# Altium schematic sheet mechanical.SchDoc: CS - Mechanical
size Letter; CheckedBy: J. Brinton; CompanyName: Signal Laboratories, Inc.; DrawnBy: J. Brinton; Engineer: J. Brinton; Address1: 3479 Edison Way; Address2: Menlo Park CA 94025; Address3: +1 (877) 778-8435; Address4: siglabs.com; Revision: 3; SheetNumber: 47; SheetTotal: 47
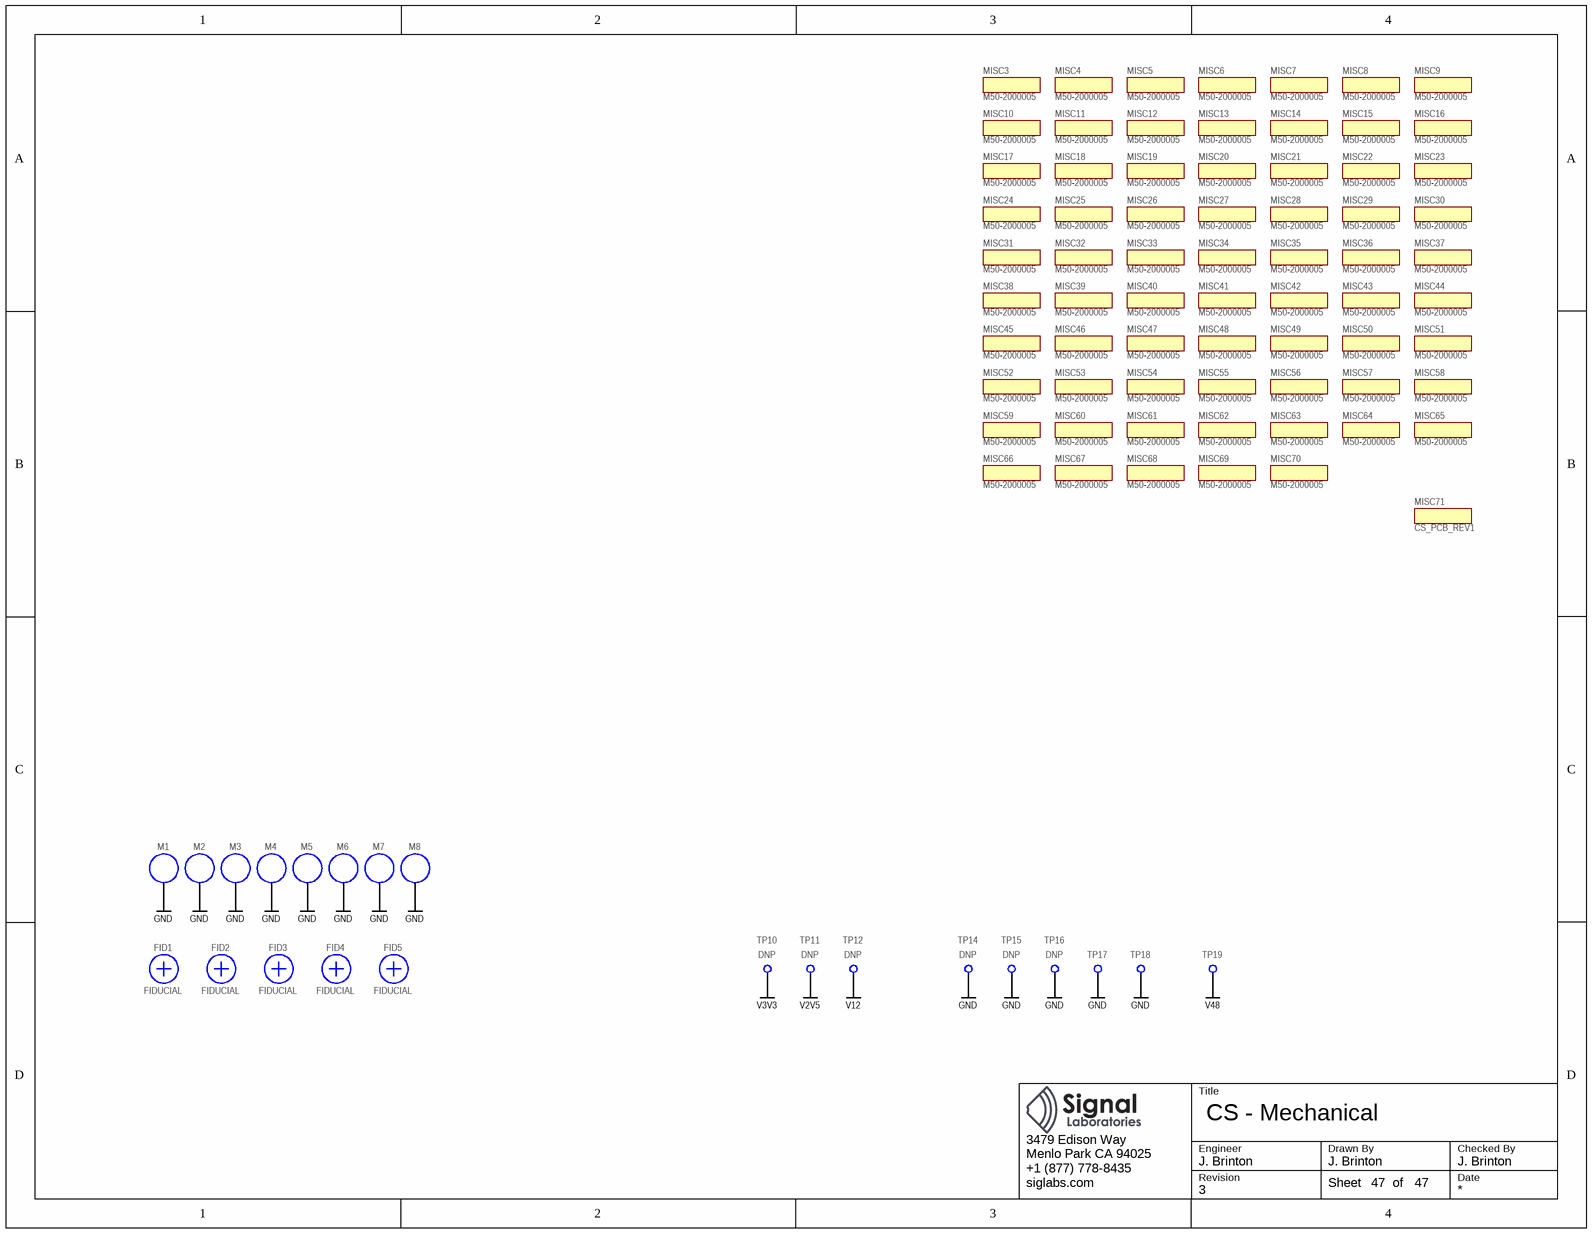
[diagram p0: mechanical.SchDoc]

## Parts
FID1  FIDUCIAL  [FIDUCIAL]  (no BOM)
FID2  FIDUCIAL  [FIDUCIAL]  (no BOM)
FID3  FIDUCIAL  [FIDUCIAL]  (no BOM)
FID4  FIDUCIAL  [FIDUCIAL]  (no BOM)
FID5  FIDUCIAL  [FIDUCIAL]  (no BOM)
M1  MOUNT  [MOUNTM3]  (value not drawn)  (no BOM)
M2  MOUNT  [MOUNTM3]  (value not drawn)  (no BOM)
M3  MOUNT  [MOUNTM3]  (value not drawn)  (no BOM)
M4  MOUNT  [MOUNTM3]  (value not drawn)  (no BOM)
M5  MOUNT  [MOUNTM3]  (value not drawn)  (no BOM)
M6  MOUNT  [MOUNTM3]  (value not drawn)  (no BOM)
M7  MOUNT  [MOUNTM3]  (value not drawn)  (no BOM)
M8  MOUNT  [MOUNTM3]  (value not drawn)  (no BOM)
MISC3  M50-2000005  (mechanical)
MISC4  M50-2000005  (mechanical)
MISC5  M50-2000005  (mechanical)
MISC6  M50-2000005  (mechanical)
MISC7  M50-2000005  (mechanical)
MISC8  M50-2000005  (mechanical)
MISC9  M50-2000005  (mechanical)
MISC10  M50-2000005  (mechanical)
MISC11  M50-2000005  (mechanical)
MISC12  M50-2000005  (mechanical)
MISC13  M50-2000005  (mechanical)
MISC14  M50-2000005  (mechanical)
MISC15  M50-2000005  (mechanical)
MISC16  M50-2000005  (mechanical)
MISC17  M50-2000005  (mechanical)
MISC18  M50-2000005  (mechanical)
MISC19  M50-2000005  (mechanical)
MISC20  M50-2000005  (mechanical)
MISC21  M50-2000005  (mechanical)
MISC22  M50-2000005  (mechanical)
MISC23  M50-2000005  (mechanical)
MISC24  M50-2000005  (mechanical)
MISC25  M50-2000005  (mechanical)
MISC26  M50-2000005  (mechanical)
MISC27  M50-2000005  (mechanical)
MISC28  M50-2000005  (mechanical)
MISC29  M50-2000005  (mechanical)
MISC30  M50-2000005  (mechanical)
MISC31  M50-2000005  (mechanical)
MISC32  M50-2000005  (mechanical)
MISC33  M50-2000005  (mechanical)
MISC34  M50-2000005  (mechanical)
MISC35  M50-2000005  (mechanical)
MISC36  M50-2000005  (mechanical)
MISC37  M50-2000005  (mechanical)
MISC38  M50-2000005  (mechanical)
MISC39  M50-2000005  (mechanical)
MISC40  M50-2000005  (mechanical)
MISC41  M50-2000005  (mechanical)
MISC42  M50-2000005  (mechanical)
MISC43  M50-2000005  (mechanical)
MISC44  M50-2000005  (mechanical)
MISC45  M50-2000005  (mechanical)
MISC46  M50-2000005  (mechanical)
MISC47  M50-2000005  (mechanical)
MISC48  M50-2000005  (mechanical)
MISC49  M50-2000005  (mechanical)
MISC50  M50-2000005  (mechanical)
MISC51  M50-2000005  (mechanical)
MISC52  M50-2000005  (mechanical)
MISC53  M50-2000005  (mechanical)
MISC54  M50-2000005  (mechanical)
MISC55  M50-2000005  (mechanical)
MISC56  M50-2000005  (mechanical)
MISC57  M50-2000005  (mechanical)
MISC58  M50-2000005  (mechanical)
MISC59  M50-2000005  (mechanical)
MISC60  M50-2000005  (mechanical)
MISC61  M50-2000005  (mechanical)
MISC62  M50-2000005  (mechanical)
MISC63  M50-2000005  (mechanical)
MISC64  M50-2000005  (mechanical)
MISC65  M50-2000005  (mechanical)
MISC66  M50-2000005  (mechanical)
MISC67  M50-2000005  (mechanical)
MISC68  M50-2000005  (mechanical)
MISC69  M50-2000005  (mechanical)
MISC70  M50-2000005  (mechanical)
MISC71  CS_PCB_REV1  (mechanical)
TP10  Do Not Place: DNP  [TEST_POINT]  (hidden comment: 5000)
TP11  Do Not Place: DNP  [TEST_POINT]  (hidden comment: 5000)
TP12  Do Not Place: DNP  [TEST_POINT]  (hidden comment: 5000)
TP14  Do Not Place: DNP  [TEST_POINT]  (hidden comment: 5000)
TP15  Do Not Place: DNP  [TEST_POINT]  (hidden comment: 5000)
TP16  Do Not Place: DNP  [TEST_POINT]  (hidden comment: 5000)
TP17  5000  [TEST_POINT]  (value not drawn)
TP18  5000  [TEST_POINT]  (value not drawn)
TP19  5000  [TEST_POINT]  (value not drawn)

## Nets
GND: M1.1(MNT) M2.1(MNT) M3.1(MNT) M4.1(MNT) M5.1(MNT) M6.1(MNT) M7.1(MNT) M8.1(MNT) TP14.1 TP15.1 TP16.1 TP17.1 TP18.1
V2V5: TP11.1
V3V3: TP10.1
V12: TP12.1
V48: TP19.1

## Notes on the sheet
- Title
- Engineer
- Revision
- Drawn By
- Checked By
- Date
- Sheet
- of

## Library data of the parts
M1-M8 = MOUNT: M3 Standard Fit Hole; Manufacturer: *; Manufacturer P/N: *
MISC3-MISC70 = M50-1900005: 1.27mm Jumper Socket; Manufacturer: Harwin; Do Not Place: PURCHASE BUT DNP; Manufacturer P/N: M50-2000005
MISC71 = M50-1900005: Copper Suicide PCB; Manufacturer: Signal Laboratories, Inc.; Manufacturer P/N: CS_PCB_REV1
TP10-TP12 TP14-TP19 = TEST_POINT: Thruhole Miniature Test Point; Manufacturer: Keystone Electronics Corp; Manufacturer P/N: 5000
  TP17-TP19: Do Not Place: *